# Altium project STM32_LQFP64_DEVELOPMENT_BOARD.PrjPcb
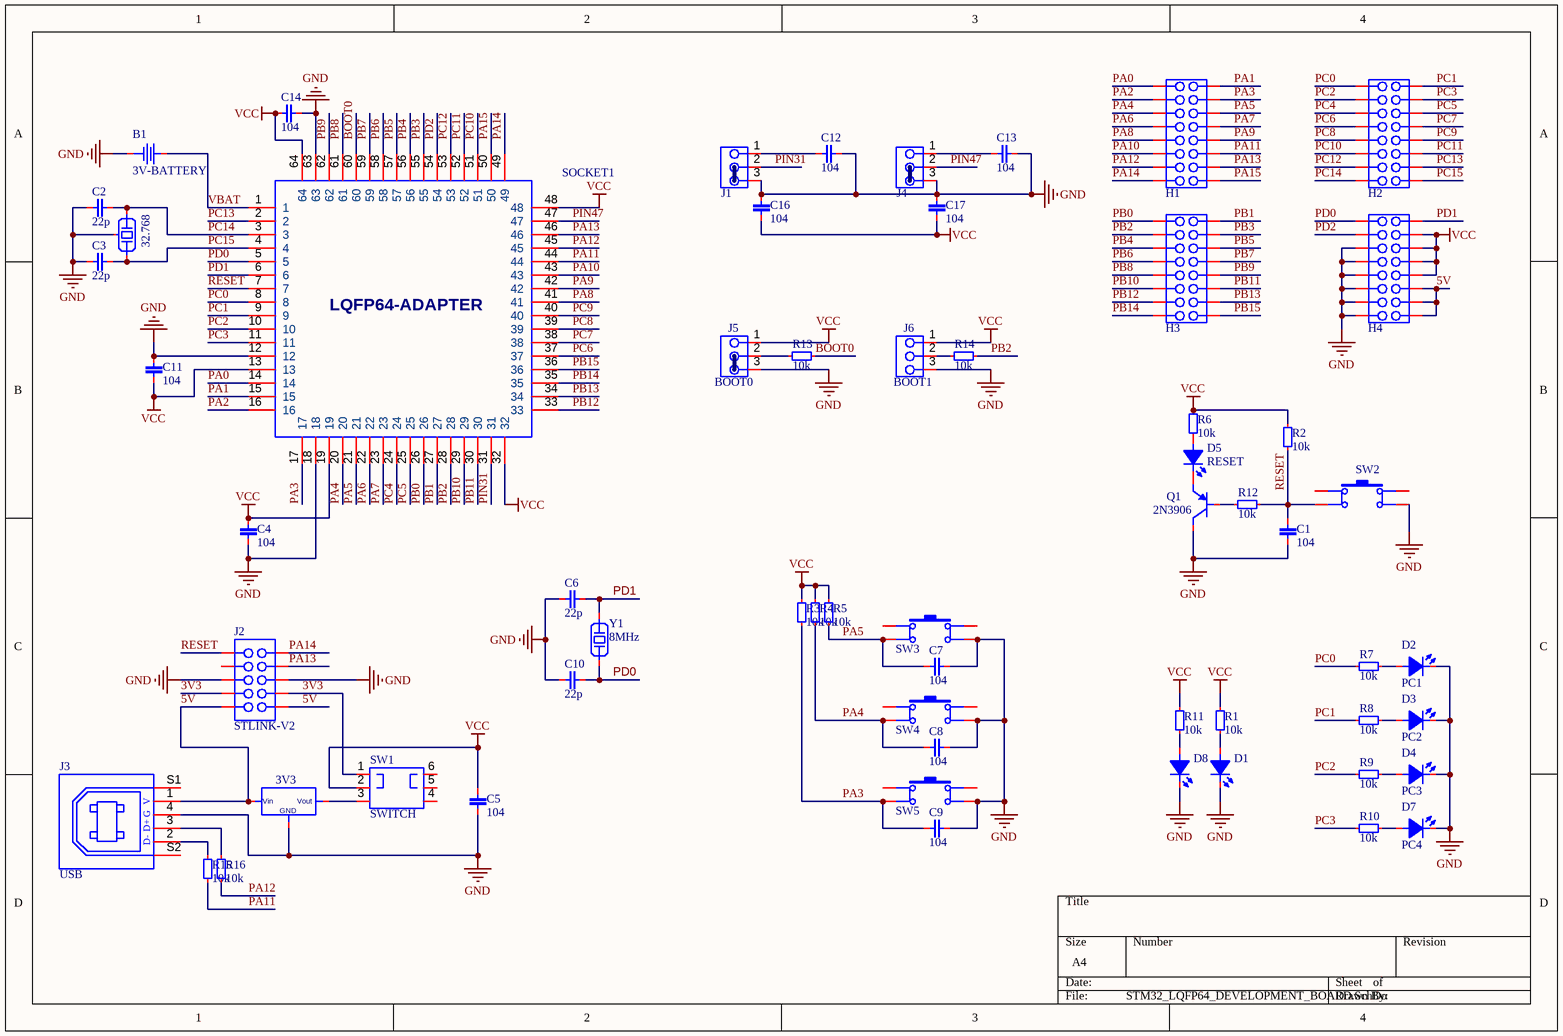
[diagram p0: STM32_LQFP64_DEVELOPMENT_BOARD.SchDoc]
1 sheet, 60 parts. Net scope: global (net labels, ports and power ports of the same name join across sheets).
Board file: STM32_LQFP64_DEVELOPMENT_BOARD.PcbDoc

## Sheet STM32_LQFP64_DEVELOPMENT_BOARD.SchDoc
size A4; SheetNumber: 1; SheetTotal: 1

### Parts
B1  3V-BATTERY  [CR1220]
C1  104  [C0805]
C2  22p  [C0805]
C3  22p  [C0805]
C4  104  [C0805]
C5  104  [C1812]
C6  22p  [C0805]
C7  104  [C0805]
C8  104  [C0805]
C9  104  [C0805]
C10  22p  [C0805]
C11  104  [C0805]
C12  104  [C0805]
C13  104  [C0805]
C14  104  [C0805]
C16  104  [C0805]
C17  104  [C0805]
D1  LED0805  [L0805RED]  (value not drawn)
D2  PC1  [L0805RED]
D3  PC2  [L0805RED]
D4  PC3  [L0805RED]
D5  RESET  [L0805RED]
D7  PC4  [L0805RED]
D8  LED0805  [L0805RED]  (value not drawn)
H1  HEADER-MALE-DOUBLE  [HEADER-MALE-DOUBLE-16PINS-2.54MM]  (value not drawn)
H2  HEADER-MALE-DOUBLE  [HEADER-MALE-DOUBLE-16PINS-2.54MM]  (value not drawn)
H3  HEADER-MALE-DOUBLE  [HEADER-MALE-DOUBLE-16PINS-2.54MM]  (value not drawn)
H4  HEADER-MALE-DOUBLE  [HEADER-MALE-DOUBLE-16PINS-2.54MM]  (value not drawn)
J1  PIN31  [HEADER-MALE-03PINS-2.54MM]  (value not drawn)
J2  STLINK-V2  [IDC_CONNECTOR_10x2.54]
J3  USB  [USB-B-TYPE]
J4  PIN47  [HEADER-MALE-03PINS-2.54MM]  (value not drawn)
J5  BOOT0  [HEADER-MALE-03PINS-2.54MM]
J6  BOOT1  [HEADER-MALE-03PINS-2.54MM]
Q1  2N3906  [SOT23-3]
R1  10k  [R0805]
R2  10k  [R0805]
R3  10k  [R0805]
R4  10k  [R0805]
R5  10k  [R0805]
R6  10k  [R0805]
R7  10k  [R0805]
R8  10k  [R0805]
R9  10k  [R0805]
R10  10k  [R0805]
R11  10k  [R0805]
R12  10k  [R0805]
R13  10k  [R0805]
R14  10k  [R0805]
R15  10k  [R0805]
R16  10k  [R0805]
SOCKET1  STM32 MICROCONTROLLER  [SOCKET-ADAPTER-OTQ-64-05-03]  (value not drawn)
SW1  SWITCH  [SWITCH 5.8x5.8 6 PINS]
SW2  RESET  [BUTTON_HOLE_4.3mm]  (value not drawn)
SW3  PG5  [BUTTON_HOLE_4.3mm]  (value not drawn)
SW4  PG6  [BUTTON_HOLE_4.3mm]  (value not drawn)
SW5  PG7  [BUTTON_HOLE_4.3mm]  (value not drawn)
U1  3V3  [SOT223-3]
Y1  8MHz  [HC-49_THROUGH]
Y2  32.768  [DT-26]

### Nets
GND: B1.2 C1.1 C2.2 C3.2 C4.1 C5.1 C6.1 C7.2 C8.2 C9.2 C10.1 C11.2 C12.1 C13.1 C14.1 C16.1 C17.1 D1.2(K) D2.2(K) D3.2(K) D4.2(K) D7.2(K) D8.2(K) H4.5 H4.7 H4.9 H4.11 H4.13 H4.15 J1.3 J2.5 J2.6 J3.4 J4.3 J5.3 J6.3 Q1.3(C) SOCKET1.12 SOCKET1.18 SOCKET1.63 SW2.4 SW3.4 SW4.4 SW5.4 U1.1 Y2.3(GND)
VCC: C4.2 C5.2 C11.1 C14.2 C16.2 C17.2 H4.4 H4.6 H4.8 H4.10 J5.1 J6.1 R1.2 R2.1 R3.1 R4.1 R5.1 R6.2 R11.2 SOCKET1.13 SOCKET1.19 SOCKET1.32 SOCKET1.48 SOCKET1.64 SW1.2
3V3: J2.7 J2.8 SW1.1
5V: H4.12 H4.14 H4.16 J2.9 J2.10 J3.1 U1.3
BOOT0: R13.2 SOCKET1.60
PA0: H1.1 SOCKET1.14
PA1: H1.2 SOCKET1.15
PA2: H1.3 SOCKET1.16
PA3: C9.1 H1.4 R3.2 SOCKET1.17 SW5.2
PA4: C8.1 H1.5 R4.2 SOCKET1.20 SW4.2
PA5: C7.1 H1.6 R5.2 SOCKET1.21 SW3.2
PA6: H1.7 SOCKET1.22
PA7: H1.8 SOCKET1.23
PA8: H1.9 SOCKET1.41
PA9: H1.10 SOCKET1.42
PA10: H1.11 SOCKET1.43
PA11: H1.12 R15.1 SOCKET1.44
PA12: H1.13 R16.1 SOCKET1.45
PA13: H1.14 J2.4 SOCKET1.46
PA14: H1.15 J2.2 SOCKET1.49
PA15: H1.16 SOCKET1.50
PB0: H3.1 SOCKET1.26
PB1: H3.2 SOCKET1.27
PB2: H3.3 R14.2 SOCKET1.28
PB3: H3.4 SOCKET1.55
PB4: H3.5 SOCKET1.56
PB5: H3.6 SOCKET1.57
PB6: H3.7 SOCKET1.58
PB7: H3.8 SOCKET1.59
PB8: H3.9 SOCKET1.61
PB9: H3.10 SOCKET1.62
PB10: H3.11 SOCKET1.29
PB11: H3.12 SOCKET1.30
PB12: H3.13 SOCKET1.33
PB13: H3.14 SOCKET1.34
PB14: H3.15 SOCKET1.35
PB15: H3.16 SOCKET1.36
PC0: H2.1 R7.2 SOCKET1.8
PC1: H2.2 R8.2 SOCKET1.9
PC2: H2.3 R9.2 SOCKET1.10
PC3: H2.4 R10.2 SOCKET1.11
PC4: H2.5 SOCKET1.24
PC5: H2.6 SOCKET1.25
PC6: H2.7 SOCKET1.37
PC7: H2.8 SOCKET1.38
PC8: H2.9 SOCKET1.39
PC9: H2.10 SOCKET1.40
PC10: H2.11 SOCKET1.51
PC11: H2.12 SOCKET1.52
PC12: H2.13 SOCKET1.53
PC13: H2.14 SOCKET1.2
PC14: C2.1 H2.15 SOCKET1.3 Y2.2
PC15: C3.1 H2.16 SOCKET1.4 Y2.1
PD0: C10.2 H4.1 SOCKET1.5 Y1.2
PD1: C6.2 H4.2 SOCKET1.6 Y1.1
PD2: H4.3 SOCKET1.54
PIN31: J1.2 SOCKET1.31
PIN47: J4.2 SOCKET1.47
RESET: C1.2 J2.1 R2.2 R12.1 SOCKET1.7 SW2.2
VBAT: B1.1 SOCKET1.1
NetC12_2: C12.2 J1.1
NetC13_2: C13.2 J4.1
NetD1_1: D1.1(A) R1.1
NetD2_1: D2.1(A) R7.1
NetD3_1: D3.1(A) R8.1
NetD4_1: D4.1(A) R9.1
NetD5_1: D5.1(A) R6.1
NetD5_2: D5.2(K) Q1.2(E)
NetD7_1: D7.1(A) R10.1
NetD8_1: D8.1(A) R11.1
NetJ3_2: J3.2 R15.2
NetJ3_3: J3.3 R16.2
NetJ5_2: J5.2 R13.1
NetJ6_2: J6.2 R14.1
NetQ1_1: Q1.1(B) R12.2
NetSW1_3: SW1.3 U1.2

Not connected (* = marked no-connect by the designer): J2 3; J3 S1 S2; SW1 4 5 6; SW2 1 3; SW3 1 3; SW4 1 3; SW5 1 3

### Notes on the sheet
- (in symbol Ic-AMS1117(SOT-223)) Vin; Vout; GND
- (in symbol Mcu-SOCKET-ADAPTER-OTQ-64-05-03) LQFP64-ADAPTER
- (in symbol USB B Type) V; G; D+; D-

### Library data of the parts
B1 = Batery
C1-C14 C16 C17 = Capacitors(SMD)
D2-D5 D7 = LED0805
H1-H4 = HEADER-MALE-DOUBLE-16PINS-2.54MM
J1 J4-J6 = HEADER-MALE-03PINS-2.54MM
J2 = IDC_2.54_5x2
J3 = USB B Type
Q1 = Transistor-2N3906 (SOT-23)
R1-R16 = Resistors-SMD
SOCKET1 = Mcu-SOCKET-ADAPTER-OTQ-64-05-03
SW1 = SWITCH-DPDT
SW2-SW5 = Button Hole
U1 = Ic-AMS1117(SOT-223)
Y1 = Crystal
Y2 = Crystal 32.768KHz